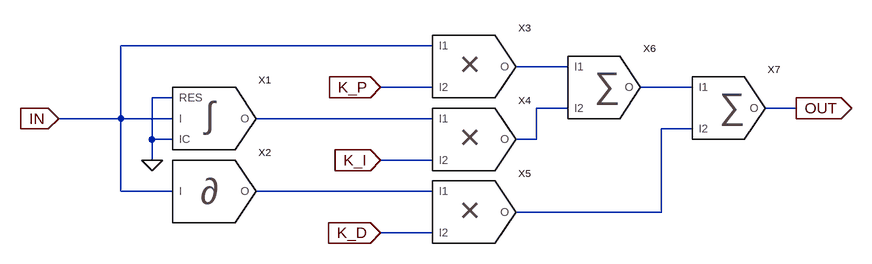
[diagram p0: schematic PID.asc]
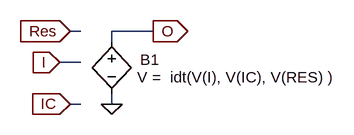
[diagram p1: sub-circuit integrator_module.asc]
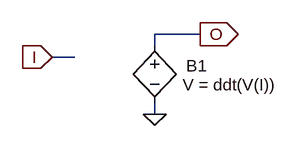
[diagram p2: sub-circuit derivator_module.asc]
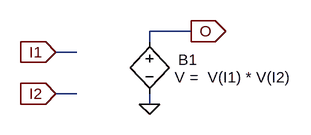
[diagram p3: sub-circuit multiplier_module.asc]
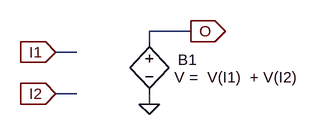
[diagram p4: sub-circuit sum_module.asc]
PID.asc, the LTspice schematic file:
Version 4
SHEET 1 1260 680
WIRE 560 64 80 64
WIRE 768 96 688 96
WIRE 560 128 480 128
WIRE 960 128 880 128
WIRE 160 144 128 144
WIRE 768 160 720 160
WIRE 1120 160 1072 160
WIRE 80 176 80 64
WIRE 80 176 -16 176
WIRE 160 176 80 176
WIRE 560 176 288 176
WIRE 960 192 912 192
WIRE 128 208 128 144
WIRE 160 208 128 208
WIRE 720 208 720 160
WIRE 720 208 688 208
WIRE 128 240 128 208
WIRE 560 240 480 240
WIRE 80 288 80 176
WIRE 160 288 80 288
WIRE 560 288 288 288
WIRE 912 320 912 192
WIRE 912 320 688 320
WIRE 560 352 480 352
FLAG 1120 160 OUT
IOPIN 1120 160 Out
FLAG 480 128 K_P
IOPIN 480 128 In
FLAG 480 240 K_I
IOPIN 480 240 In
FLAG 480 352 K_D
IOPIN 480 352 In
FLAG 128 240 0
FLAG -16 176 IN
IOPIN -16 176 In
SYMBOL integrator_module 304 160 R0
SYMATTR InstName X1
SYMBOL derivator_module 256 272 R0
SYMATTR InstName X2
SYMATTR SpiceLine k=0
SYMBOL multiplier_module 656 80 R0
SYMATTR InstName X3
SYMBOL multiplier_module 656 192 R0
SYMATTR InstName X4
SYMBOL multiplier_module 656 304 R0
SYMATTR InstName X5
SYMBOL sum_module 848 112 R0
SYMATTR InstName X6
SYMBOL sum_module 1040 144 R0
SYMATTR InstName X7

integrator_module.asc, the sub-circuit schematic file:
Version 4
SHEET 1 880 680
WIRE 128 160 112 160
WIRE 240 160 176 160
WIRE 176 176 176 160
WIRE 128 208 96 208
WIRE 128 272 112 272
WIRE 176 272 176 256
FLAG 96 208 I
IOPIN 96 208 In
FLAG 176 272 0
FLAG 240 160 O
IOPIN 240 160 Out
FLAG 112 272 IC
IOPIN 112 272 In
FLAG 112 160 Res
IOPIN 112 160 In
SYMBOL bv 176 160 R0
WINDOW 0 44 44 Left 0
WINDOW 3 39 71 Left 0
SYMATTR InstName B1
SYMATTR Value V =  idt(V(I), V(IC), V(RES) )

derivator_module.asc, the sub-circuit schematic file:
Version 4
SHEET 1 880 680
WIRE 240 160 176 160
WIRE 176 176 176 160
WIRE 64 192 32 192
WIRE 176 272 176 256
FLAG 32 192 I
IOPIN 32 192 In
FLAG 176 272 0
FLAG 240 160 O
IOPIN 240 160 Out
SYMBOL bv 176 160 R0
WINDOW 0 44 44 Left 0
WINDOW 3 39 71 Left 0
SYMATTR InstName B1
SYMATTR Value V = ddt(V(I))

multiplier_module.asc, the sub-circuit schematic file:
Version 4
SHEET 1 880 680
WIRE 240 160 176 160
WIRE 176 176 176 160
WIRE 64 192 32 192
WIRE 64 256 32 256
WIRE 176 272 176 256
FLAG 32 192 I1
IOPIN 32 192 In
FLAG 32 256 I2
IOPIN 32 256 In
FLAG 176 272 0
FLAG 240 160 O
IOPIN 240 160 Out
SYMBOL bv 176 160 R0
WINDOW 0 44 44 Left 0
WINDOW 3 39 71 Left 0
SYMATTR InstName B1
SYMATTR Value V =  V(I1) * V(I2)

sum_module.asc, the sub-circuit schematic file:
Version 4
SHEET 1 880 680
WIRE 240 160 176 160
WIRE 176 176 176 160
WIRE 64 192 32 192
WIRE 64 256 32 256
WIRE 176 272 176 256
FLAG 32 192 I1
IOPIN 32 192 In
FLAG 32 256 I2
IOPIN 32 256 In
FLAG 176 272 0
FLAG 240 160 O
IOPIN 240 160 Out
SYMBOL bv 176 160 R0
WINDOW 0 44 44 Left 0
WINDOW 3 39 71 Left 0
SYMATTR InstName B1
SYMATTR Value V =  V(I1)  + V(I2)

The netlist it stands for:
* PID.asc
XX1 N004 IN 0 0 integrator_module
XX2 N006 IN derivator_module params: k=0
XX3 N001 IN K_P multiplier_module
XX4 N003 N004 K_I multiplier_module
XX5 N005 N006 K_D multiplier_module
XX6 N002 N001 N003 sum_module
XX7 OUT N002 N005 sum_module

* block symbol definitions
.subckt integrator_module O I IC RES
B1 O 0 V =  idt(V(I), V(IC), V(RES) )
.ends integrator_module

.subckt derivator_module O I
B1 O 0 V = ddt(V(I))
.ends derivator_module

.subckt multiplier_module O I1 I2
B1 O 0 V =  V(I1) * V(I2)
.ends multiplier_module

.subckt sum_module O I1 I2
B1 O 0 V =  V(I1)  + V(I2)
.ends sum_module

.backanno
.end